# EAGLE design carret (EAGLE 5.11)
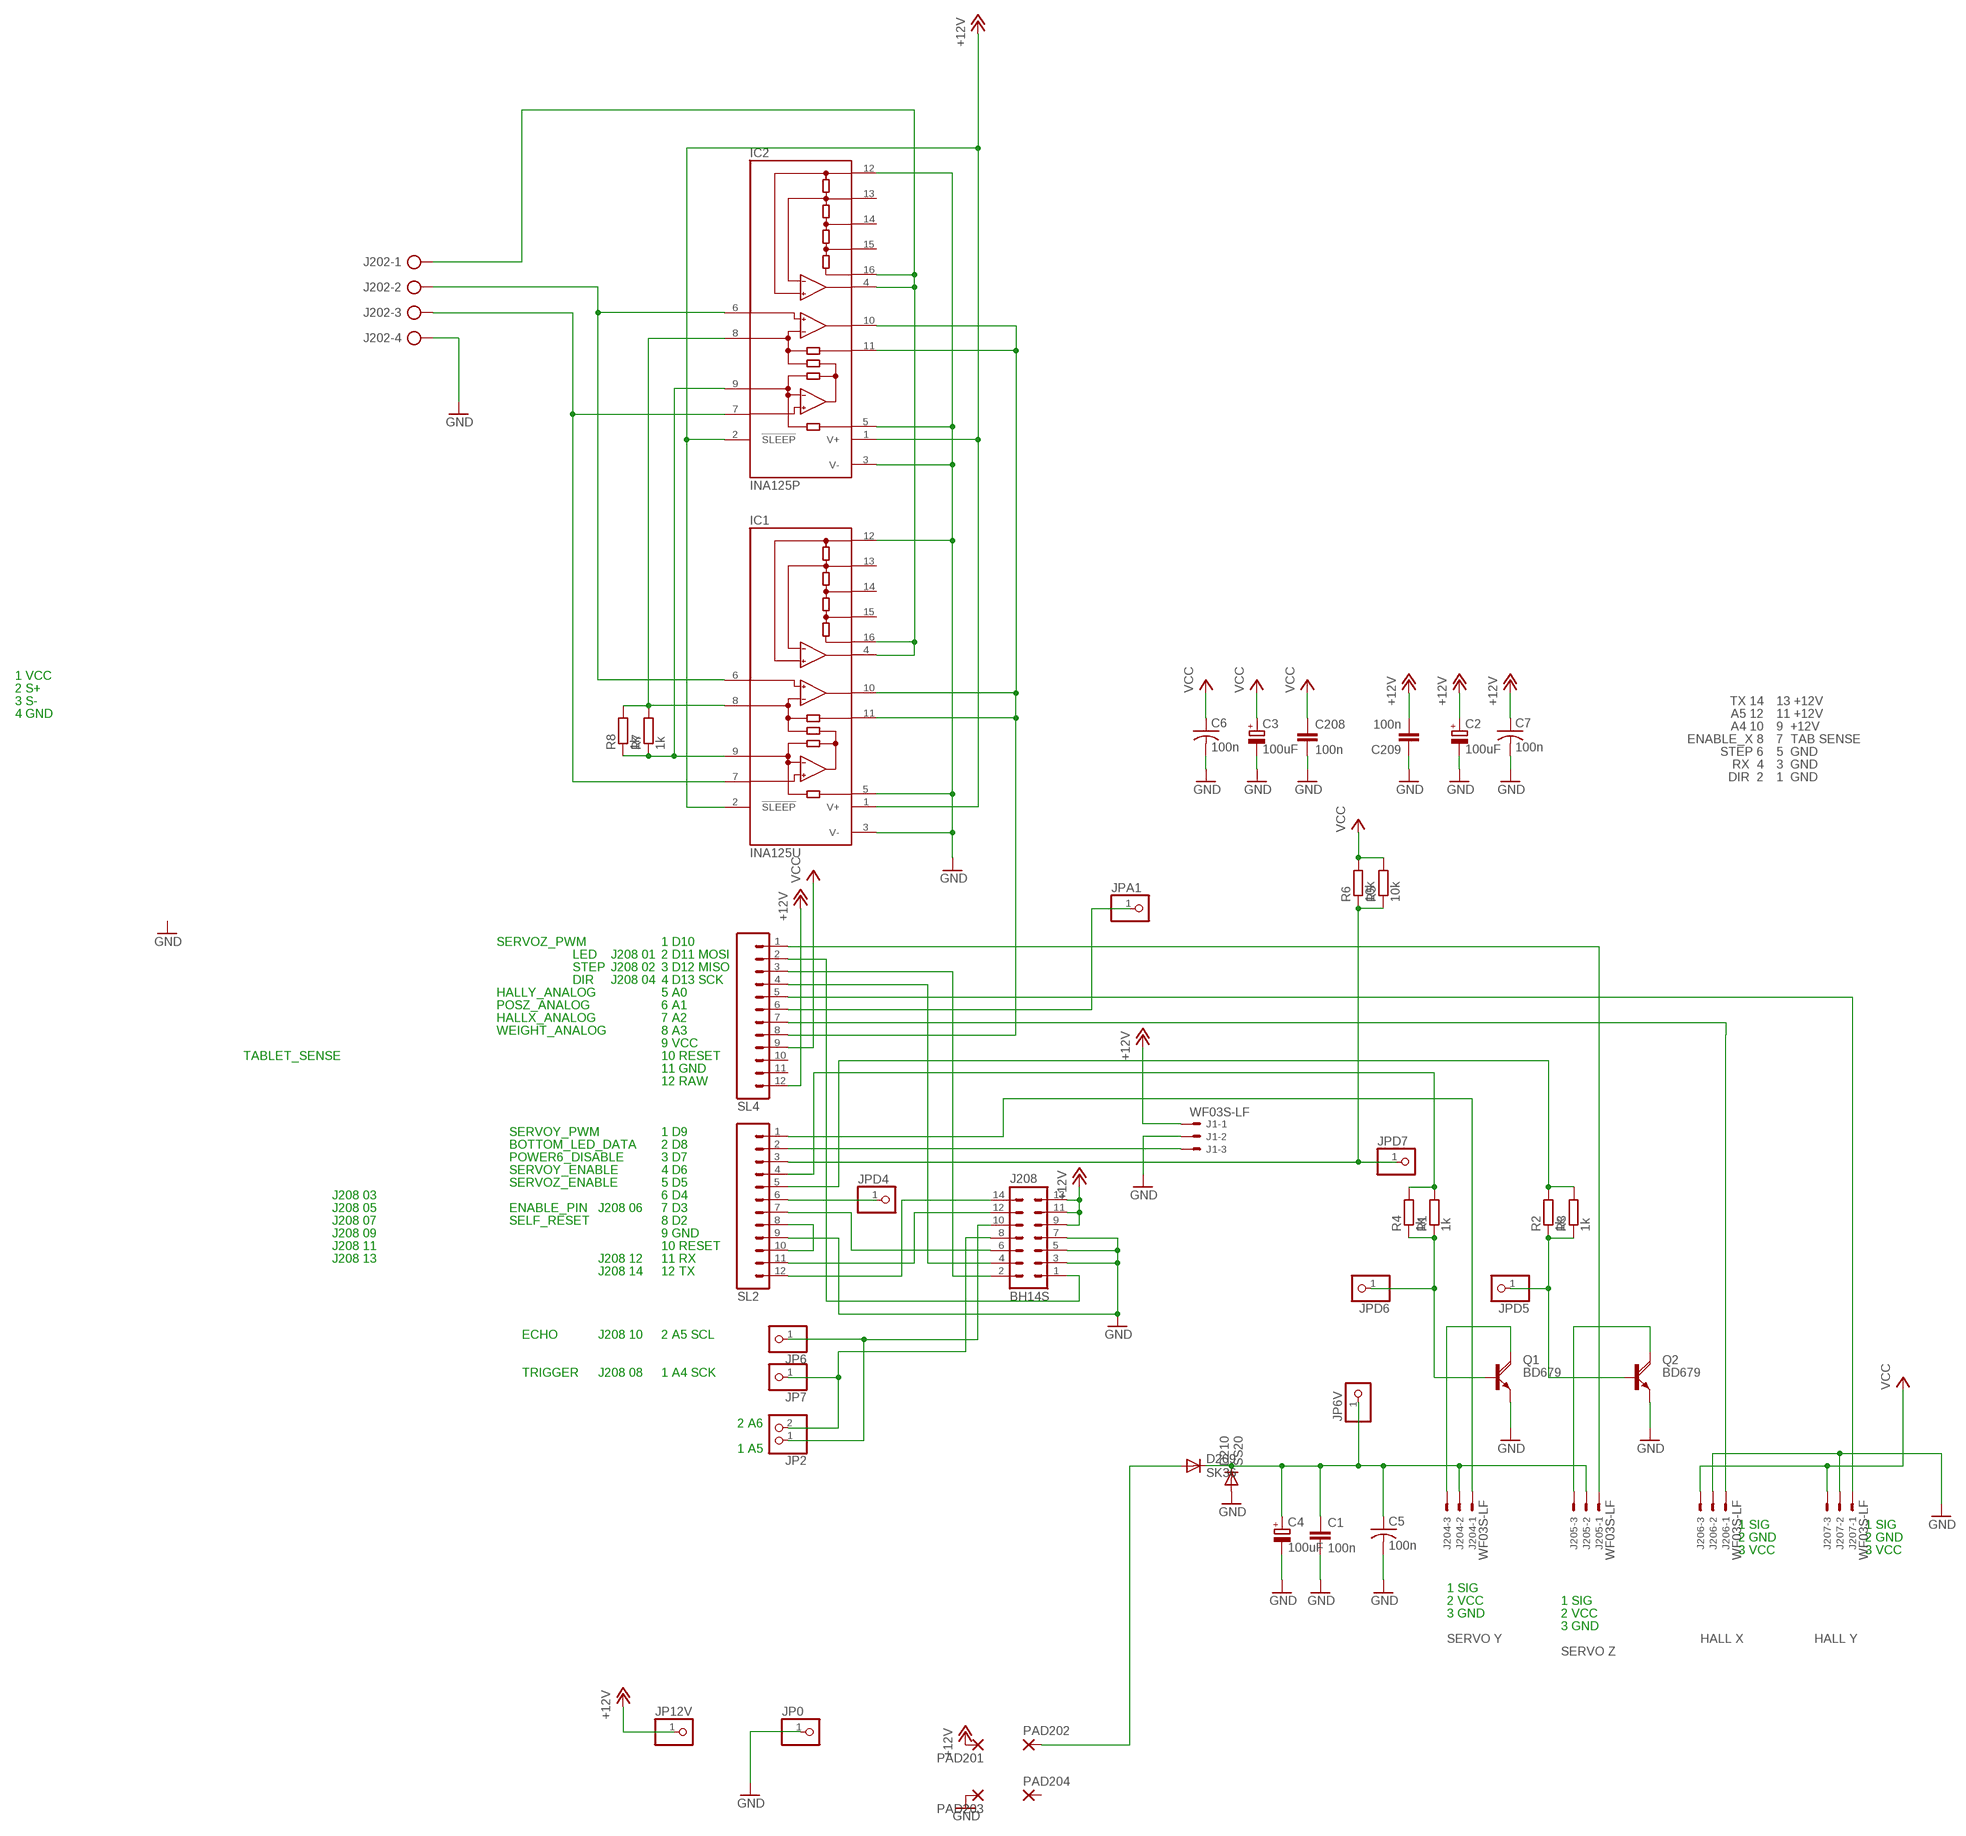
[diagram p0: schematic, sheet 1]

## Parts
C1  100n  CAP  [0805]
C2  100uF  CPOL-EUE3.5-8  [E3,5-8]
C3  100uF  CPOL-EUE3.5-8  [E3,5-8]
C4  100uF  CPOL-EUE3.5-8  [E3,5-8]
C5  100n  C-US050-030X075  [C050-030X075]
C6  100n  C-US050-030X075  [C050-030X075]
C7  100n  C-US050-030X075  [C050-030X075]
C208  100n  CAP  [0805]
C209  100n  CAP  [0805]
D209  SK36  DIODE-SMC  [SMC]
D210  SS20  DIODE-DO214AA  [DO214AA]
IC1  INA125U  [SO16-1]
IC2  INA125P  [DIL16]
J1  WF03S-LF  22-27-2031-03  [6410-03]
J202  AK300/4  [AK300/4]
J204  WF03S-LF  22-27-2031-03  [6410-03]
J205  WF03S-LF  22-27-2031-03  [6410-03]
J206  WF03S-LF  22-27-2031-03  [6410-03]
J207  WF03S-LF  22-27-2031-03  [6410-03]
J208  BH14S  ML14  [ML14]
JP0  PINHD-1X1  [1X01]
JP2  PINHD-1X2  [1X02]
JP6  PINHD-1X1  [1X01]
JP6V  PINHD-1X1  [1X01]
JP7  PINHD-1X1  [1X01]
JP12V  PINHD-1X1  [1X01]
JPA1  PINHD-1X1  [1X01]
JPD4  PINHD-1X1  [1X01]
JPD5  PINHD-1X1  [1X01]
JPD6  PINHD-1X1  [1X01]
JPD7  PINHD-1X1  [1X01]
PAD201  3,81/1,1  [3,81/1,1]
PAD202  3,81/1,1  [3,81/1,1]
PAD203  3,81/1,1  [3,81/1,1]
PAD204  3,81/1,1  [3,81/1,1]
Q1  BD679  [TO126AV]
Q2  BD679  [TO126AV]
R1  1k  RES0805  [0805]
R2  1k  RES0805  [0805]
R3  1k  R-EU_0207/10  [0207/10]
R4  1k  R-EU_0207/10  [0207/10]
R5  10k  RES0805  [0805]
R6  10k  R-EU_0207/10  [0207/10]
R7  1k  RES0805  [0805]
R8  1k  R-EU_0207/10  [0207/10]
SL2  M12  [12P]
SL4  M12  [12P]

## Nets
+12V [power12]: C2.+ C7.1 C209.2 IC1.1(V+) IC1.2(!SLEEP) IC2.1(V+) IC2.2(!SLEEP) J1.1 J208.9 J208.11 J208.13 JP12V.1 PAD201.1(P) SL4.12
GND [ground]: C1.2 C2.- C3.- C4.- C5.2 C6.2 C7.2 C208.2 C209.1 D210.A IC1.3(V-) IC1.5(REF) IC1.12(REFCOM) IC2.3(V-) IC2.5(REF) IC2.12(REFCOM) J1.2 J202.4 J206.2 J207.2 J208.3 J208.5 J208.7 JP0.1 PAD203.1(P) Q1.E Q2.E SL2.9
N$1: JPD6.1 Q1.B R1.1 R4.1
N$2: J208.14 SL2.12
N$3: J1.3 SL2.2
N$4: JPD7.1 R5.1 R6.1 SL2.3
N$5: J206.1 SL4.7
N$6: J208.1 SL4.2
N$7: J208.12 SL2.11
N$8: J208.2 SL4.3
N$9: J208.10 JP2.1 JP6.1
N$10: J205.1 SL4.1
N$11: J208.8 JP2.2 JP7.1
N$12: J208.4 SL4.4
N$13: IC1.6(+IN) IC2.6(+IN) J202.2
N$14 [power12]: D209.A PAD202.1(P)
N$15: SL2.8 SL2.10
N$16: J207.1 SL4.5
N$17: J204.3 Q1.C
N$18: R1.2 R4.2 SL2.4
N$19: R2.2 R3.2 SL2.5
N$20: J205.3 Q2.C
N$21: J204.1 SL2.1
N$22 [power6]: C1.1 C4.+ C5.1 D209.C D210.C J204.2 J205.2 JP6V.1
N$23: JPD5.1 Q2.B R2.1 R3.1
N$24: JPD4.1 SL2.6
N$25: IC1.4(REFOUT) IC1.16(REF10) IC2.4(REFOUT) IC2.16(REF10) J202.1
N$26: IC1.7(-IN) IC2.7(-IN) J202.3
N$27: J208.6 SL2.7
N$28: JPA1.1 SL4.6
N$30: IC1.8(RG) IC2.8(RG) R7.2 R8.2
N$31: IC1.9(RG) IC2.9(RG) R7.1 R8.1
N$41: IC1.10(OUT) IC1.11(SENSE) IC2.10(OUT) IC2.11(SENSE) SL4.8
VCC [power5]: C3.+ C6.1 C208.1 J206.3 J207.3 R5.2 R6.2 SL4.9
Unconnected: IC1.13(REFBG) IC1.14(REF2.5) IC1.15(REF5) IC2.13(REFBG) IC2.14(REF2.5) IC2.15(REF5) PAD204.1(P) SL4.10 SL4.11

## Notes on the sheet
- 1 VCC
- 2 S+
- 3 S- | TX 14 | 13 +12V
- 4 GND | A5 12 | 11 +12V
- A4 10 | 9  +12V
- ENABLE_X 8 | 7  TAB SENSE
- STEP 6 | 5  GND
- RX  4 | 3  GND
- DIR  2 | 1  GND
- SERVOZ_PWM | 1 D10
- LED | J208 01 | 2 D11 MOSI
- STEP | J208 02 | 3 D12 MISO
- DIR | J208 04 | 4 D13 SCK
- HALLY_ANALOG | 5 A0
- POSZ_ANALOG | 6 A1
- HALLX_ANALOG | 7 A2
- WEIGHT_ANALOG | 8 A3
- 9 VCC
- TABLET_SENSE | 10 RESET
- 11 GND
- 12 RAW
- SERVOY_PWM | 1 D9
- BOTTOM_LED_DATA | 2 D8
- POWER6_DISABLE | 3 D7
- SERVOY_ENABLE | 4 D6
- SERVOZ_ENABLE | 5 D5
- J208 03 | 6 D4
- J208 05 | ENABLE_PIN | J208 06 | 7 D3
- J208 07 | SELF_RESET | 8 D2
- J208 09 | 9 GND
- J208 11 | 10 RESET
- J208 13 | J208 12 | 11 RX
- J208 14 | 12 TX
- ECHO | J208 10 | 2 A5 SCL
- TRIGGER | J208 08 | 1 A4 SCK
- 2 A6
- 1 A5
- 1 SIG | 1 SIG
- 2 GND | 2 GND
- 3 VCC | 3 VCC
- 1 SIG
- 2 VCC | 1 SIG
- 3 GND | 2 VCC
- 3 GND
- SERVO Y | HALL X | HALL Y
- SERVO Z

## Library data of the parts
C1 C208 C209 = barobot:CAP
C2-C4 = rcl:CPOL-EU: POLARIZED CAPACITOR, European symbol
C5-C7 = resistor:C-US: CAPACITOR, American symbol
D209 D210 = diode:DIODE-: DIODE
IC1 = burr-brown:INA125: Instrumentation Amplifier with Precision Voltage Reference; MF: TEXAS INSTRUMENT CONNECTORS; MPN: INA125U; OC_FARNELL: 1304375; OC_NEWARK: 80K5901
IC2 = burr-brown:INA125: Instrumentation Amplifier with Precision Voltage Reference; MF: TEXAS INSTRUMENT CONNECTORS; MPN: INA125P; OC_FARNELL: 1459461; OC_NEWARK: 35C1726
J1 J204-J207 = con-molex:22-?-03: CONNECTOR wire to board 2.54 mm (.1 inch) pitch header; OC_FARNELL: unknown; OC_NEWARK: unknown
J202 = con-ptr500:AK300/4: CONNECTOR
J208 = con-ml:ML14: HARTING
JP0 JP6 JP6V JP7 JP12V JPA1 JPD4-JPD7 = pinhead:PINHD-1X1: PIN HEADER
JP2 = pinhead:PINHD-1X2: PIN HEADER
PAD201-PAD204 = wirepad:3,81/1,1: THROUGH-HOLE PAD
Q1 Q2 = transistor-power:BD679: NPN DARLINGTON TRANSISTOR
R1 R2 R5 R7 = barobot:RES
R3 R4 R6 R8 = rcl:R-EU_: RESISTOR, European symbol
SL2 SL4 = con-amp-quick:M12: AMP QUICK CONNECTOR; OC_FARNELL: unknown; OC_NEWARK: unknown

## Net classes
0 default: width 0.381 mm, drill 0.254 mm, clearance 0.254 mm
1 power12: width 1.27 mm
2 ground: width 0.508 mm
3 power5: width 0.508 mm
4 power6: width 0.813 mm

## Board
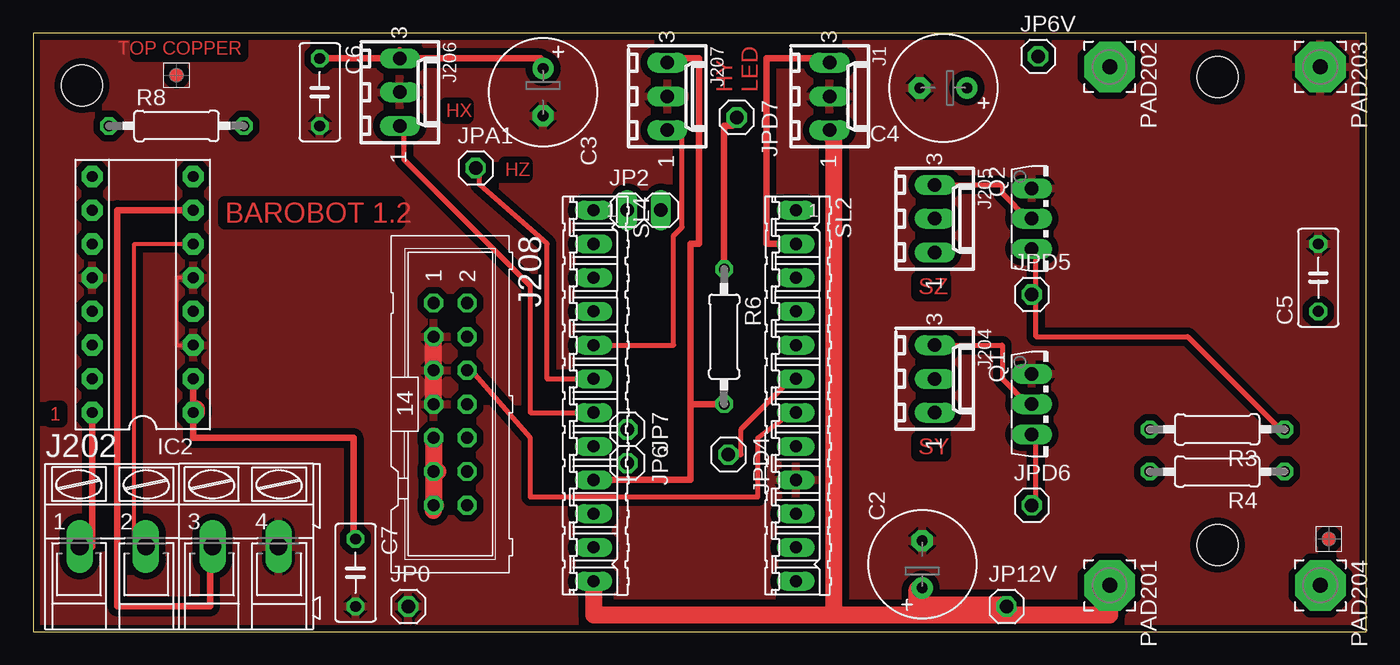
[diagram p1: board, top side]
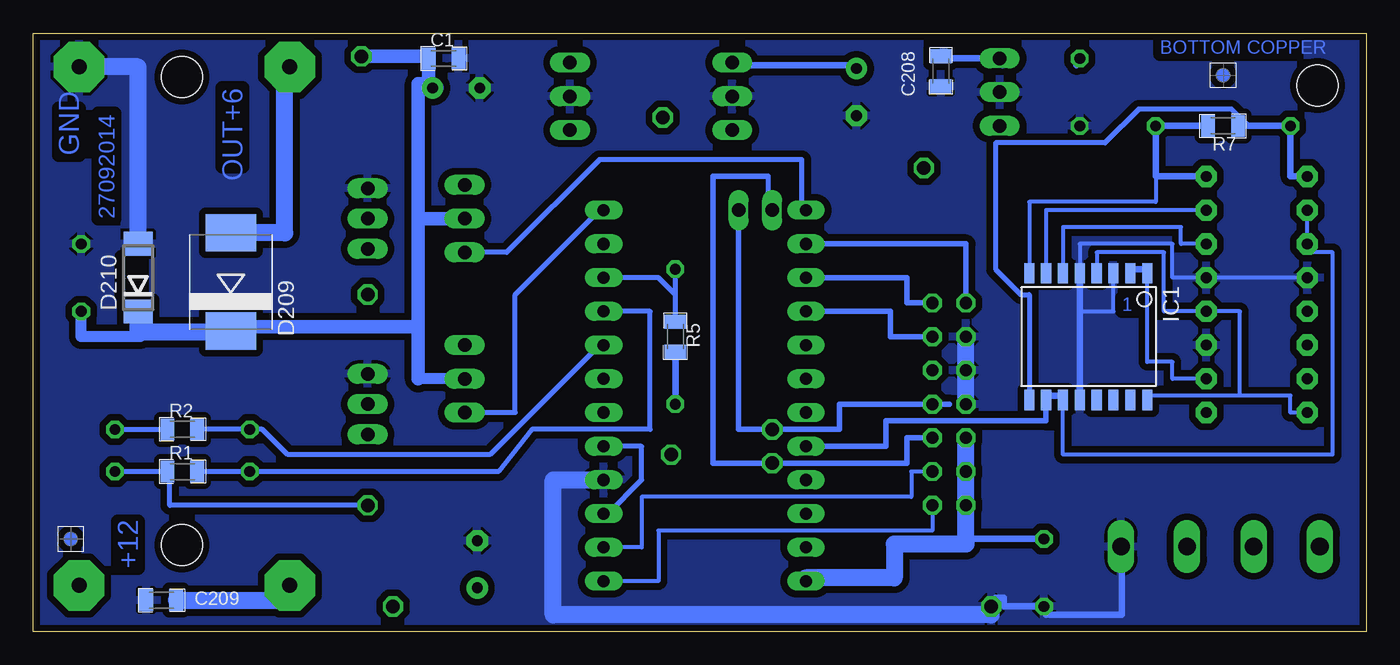
[diagram p2: board, bottom side, seen from below]

Size 100.46 x 45.09 mm. Coordinates in mm from the lower left corner, seen from the top.
Outline: 0,0 100.46,0 100.46,45.09 0,45.09 0,0
Copper layers (1*16): Top 0.035mm / dielectric 1.5mm / Bottom 0.035mm
Design rules "default *": minimum track width 10mil, minimum drill 0.5mm, track to track 10mil, track to pad 10mil, pad to pad 8mil, via to via 10mil, smd to smd 8mil, copper to edge 20mil, drill to drill 8mil, minimum pad ring 10mil, minimum via ring 8mil, stop-mask expansion 0mil, vias tented up to drill 0mil, thermal gap 10mil
Holes 3.1 mm at 89.23,6.54 89.25,41.78 3.68,41.15
bRestrict: area 92.2,25.4 to 93.8,28.3

### Footprints (pad centres in the part's own frame; a part is rotated, then mirrored left to right if it is on the bottom)
0805 = smd 1.044 x 1.6: 1 -1.127,0; 2 1.127,0
E3,5-8 = drill 0.813 pad 1.6 round: + -1.778,0 | drill 0.813 pad 1.6 octagon: - 1.778,0
C050-030X075 = drill 0.813 octagon: 1 -2.54,0; 2 2.54,0
SMC = smd 2.8 x 3.8: A 3.7,0; C -3.7,0
DO214AA = smd 1.8 x 2.2: A 2.55,0; C -2.55,0
SO16-1 = smd 0.762 x 1.524: 1 -4.445,-4.775; 2 -3.175,-4.775; 3 -1.905,-4.775; 4 -0.635,-4.775; 5 0.635,-4.775; 6 1.905,-4.775; 7 3.175,-4.775; 8 4.445,-4.775; 9 4.445,4.775; 10 3.175,4.775; 11 1.905,4.775; 12 0.635,4.775; 13 -0.635,4.775; 14 -1.905,4.775; 15 -3.175,4.775; 16 -4.445,4.775
DIL16 = drill 0.813 pad 1.6 octagon: 1 -8.89,-3.81; 2 -6.35,-3.81; 3 -3.81,-3.81; 4 -1.27,-3.81; 5 1.27,-3.81; 6 3.81,-3.81; 7 6.35,-3.81; 8 8.89,-3.81; 9 8.89,3.81; 10 6.35,3.81; 11 3.81,3.81; 12 1.27,3.81; 13 -1.27,3.81; 14 -3.81,3.81; 15 -6.35,3.81; 16 -8.89,3.81
6410-03 = drill 1.016 long: 1 2.54,0; 2 0,0; 3 -2.54,0
AK300/4 = drill 1.321 long: 1 -7.493,0; 2 -2.515,0; 3 2.515,0; 4 7.493,0
ML14 = drill 0.914 octagon: 1 -7.62,-1.27; 2 -7.62,1.27; 3 -5.08,-1.27; 4 -5.08,1.27; 5 -2.54,-1.27; 6 -2.54,1.27; 7 0,-1.27; 8 0,1.27; 9 2.54,-1.27; 10 2.54,1.27; 11 5.08,-1.27; 12 5.08,1.27; 13 7.62,-1.27; 14 7.62,1.27
1X01 = drill 1.016 octagon: 1 0,0
1X02 = drill 1.016 long: 1 -1.27,0; 2 1.27,0
3,81/1,1 = drill 1.118 pad 3.81 octagon: 1 0,0
TO126AV = drill 1.016 long: B 2.286,-1.27; C 0,-1.27; E -2.286,-1.27
0207/10 = drill 0.813 octagon: 1 -5.08,0; 2 5.08,0
12P = drill 0.914 long: 1 -13.97,0; 2 -11.43,0; 3 -8.89,0; 4 -6.35,0; 5 -3.81,0; 6 -1.27,0; 7 1.27,0; 8 3.81,0; 9 6.35,0; 10 8.89,0; 11 11.43,0; 12 13.97,0

### Placement (x,y rotation side)
C1  69.53,43.18 0 bottom
C2  66.99,5.08 90 top
C3  38.42,40.64 270 top
C4  68.58,40.96 180 top
C5  96.84,26.67 90 top
C6  21.59,40.64 270 top
C7  24.29,4.45 270 top
C208  32.07,42.23 270 bottom
C209  90.8,2.38 0 bottom
D209  85.57,26.35 90 bottom
D210  92.55,26.67 90 bottom
IC1  20.95,22.23 180 bottom
IC2  8.26,25.4 90 top
J1  60.01,40.32 270 top
J202  11,6.42 0 top
J204  67.94,19.05 270 top
J205  67.94,31.11 270 top
J206  27.62,40.64 270 top
J207  47.78,40.32 270 top
J208  31.43,17.14 270 top
JP0  28.26,1.91 0 top
JP2  46.04,31.75 0 top
JP6  44.77,12.7 270 top
JP6V  75.72,43.34 0 top
JP7  44.77,15.24 270 top
JP12V  73.34,1.91 0 top
JPA1  33.34,34.92 0 top
JPD4  52.39,13.34 270 top
JPD5  75.25,25.4 0 top
JPD6  75.25,9.53 0 top
JPD7  53.02,38.73 270 top
PAD201  81.12,3.49 270 top
PAD202  81.12,42.55 270 top
PAD203  97,42.55 270 top
PAD204  97,3.49 270 top
Q1  76.52,17.14 270 top
Q2  76.52,31.11 270 top
R1  89.22,12.06 0 bottom
R2  89.22,15.24 0 bottom
R3  89.22,15.24 180 top
R4  89.22,12.06 180 top
R5  52.07,22.23 270 bottom
R6  52.07,22.23 270 top
R7  10.79,38.1 180 bottom
R8  10.79,38.1 0 top
SL2  57.47,17.78 270 top
SL4  42.23,17.78 270 top
U$1  [FIDUCIAL_G10S]  10.79,41.91 0 top
U$2  [FIDUCIAL_G10S]  97.63,6.99 0 top
U$3  [FIDUCIAL_G10S]  97.63,6.99 0 bottom
U$4  [FIDUCIAL_G10S]  10.79,41.91 0 bottom

### Tracks (layer width: path | path; a pad name or v marks a point on that pad's centre or on a via)
+12V
  Top 0.508: IC2.2 IC2.1 12.06,14.61 24.13,14.61 24.13,6.99 C7.1
  Top 1.27: 30.29,11.94 30.16,11.94 J208.11 30.48,12.06 | J208.13 30.29,9.53 | SL4.12 42.23,1.27 60.33,1.27 | 60.33,1.27 66.61,1.27 | PAD201.1 81.12,1.27 66.61,1.27 | 30.16,14.73 J208.9 30.16,14.22 30.16,9.14 | C2.+ 66.99,3.17 66.61,3.17 66.61,2.03 | 66.61,1.27 66.61,2.03 | JP12V.1 73.34,2.03 66.61,2.03 | 60.33,1.27 60.33,37.47 60.01,37.47 J1.1 | IC2.1 12.32,16.51 12.32,16.76
  Bottom 0.305: IC1.1 16.51,20.32 14.61,20.32 14.61,19.05 IC2.2
  Bottom 0.508: IC1.1 16.51,27.3 17.78,27.3 IC1.2 | C7.1 30.16,6.99
  Bottom 1.016: J208.11 | J208.9
  Bottom 1.27: 30.16,9.4 J208.13 30.16,9.37 | 41.85,3.81 SL4.12 42.23,4.06 35.56,4.06 35.56,6.6 30.16,6.6 30.16,6.99 30.16,9.37 | C209.2 89.63,2.38 89.63,2.35 81.12,2.35 PAD201.1 80.99,3.49 80.99,3.11 | 30.16,9.37 J208.11 J208.9
GND
  Top 0.305: IC2.3 10.79,21.59 10.79,26.67 IC2.5
  Top 1.27: J208.7 J208.3
  Bottom 0.305: 28.26,1.27 28.57,1.27 | 28.26,1.27 | IC1.5 21.59,29.21 14.61,29.21 14.61,26.67 IC2.5 IC2.12 | IC1.3 19.05,24.13 21.59,24.13
  Bottom 0.508: JP0.1 27.94,1.91 27.94,2.54 27.3,2.54 27.3,1.91 C7.2 24.13,1.91 24.13,1.27 18.41,1.27 18.41,6.35 18.49,6.35 J202.4 | IC1.5 21.59,24.13 IC1.12
  Bottom 1.016: C4.- 66.99,40.96
  Bottom 1.27: 28.26,1.27 61.28,1.27 61.28,11.43 SL2.9 | J208.7 J208.5 J208.3 | PAD203.1 92.55,42.55 D210.A
  pour Top (isolate 0.508, rank 3): 0,45.09 100.33,45.09 100.33,0 0,0
  pour Bottom (isolate 0.508): 0,45.09 100.33,45.09 100.46,0 0,0
N$1
  Top 0.381: Q1.B 75.56,14.61 75.56,9.53 JPD6.1
  Bottom 0.381: JPD6.1 90.17,9.53 90.17,12.06 R1.1 90.81,12.06 93.98,12.06 R4.1
N$2
  Bottom 0.305: J208.14 32.7,7.62 53.34,7.62 53.34,3.81 SL2.12
N$3
  Top 0.508: J1.3 60.01,43.18 55.24,43.18 55.24,29.21 SL2.2
N$4
  Top 0.508: R6.1 52.07,38.1 52.7,38.1 52.7,38.73 JPD7.1
  Bottom 0.381: 52.07,25.4 R6.1 | R5.1 52.07,25.4 | 52.07,25.4 53.34,26.67 SL2.3
N$5
  Top 0.381: SL4.7 37.47,16.51 37.47,26.04 27.94,35.56 27.94,38.1 J206.1
N$6
  Bottom 0.406: SL4.2 30.16,29.21 J208.1
N$7
  Bottom 0.305: J208.12 34.29,12.06 34.29,10.16 54.61,10.16 54.61,6.35 SL2.11
N$8
  Bottom 0.406: J208.2 34.61,24.77 34.61,26.67 SL4.3
N$9
  Bottom 0.381: 45.09,34.29 45.09,31.75 JP2.1
  Bottom 0.406: J208.10 34.61,14.61 34.61,12.7 JP6.1 49.21,12.7 49.21,34.29 45.09,34.29
N$10
  Bottom 0.381: SL4.1 42.55,31.75 42.55,35.56 57.78,35.56 64.77,28.57 J205.1
N$11
  Bottom 0.406: 47.31,22.86 JP2.2 | 31.43,17.14 J208.8 39.69,17.14 39.69,15.24 JP7.1 47.31,15.24 47.31,22.86 | 47.31,22.86
N$12
  Bottom 0.406: J208.4 35.88,22.23 35.88,24.13 SL4.4
N$13
  Top 0.305: IC2.6 7.62,29.21 7.62,6.99 8.26,6.99 8.26,6.42 J202.2
  Bottom 0.305: IC1.6 22.86,30.48 13.97,30.48 13.97,29.21 IC2.6
N$14
  Bottom 1.27: D209.A 85.57,30.04 81.5,30.04 81.5,42.55 PAD202.1
N$15
  Bottom 0.381: SL2.10 57.15,8.89 54.61,11.43 54.61,13.97 SL2.8
N$16
  Top 0.381: SL4.5 48.26,21.59 48.26,29.84 48.9,30.48 48.9,37.47 48.26,38.1 J207.1
N$17
  Top 0.381: J204.3 73.03,21.59 73.03,19.05 74.93,17.14 Q1.C | J204.3
N$18
  Bottom 0.381: 84.45,12.06 87.63,12.06 R1.2 | 84.45,12.06 65.41,12.06 62.87,15.24 53.98,15.24 53.98,24.13 SL2.4 | 84.45,12.06 R4.2
N$19
  Bottom 0.381: R2.2 R3.2 83.19,15.24 81.28,13.34 66.04,13.34 57.78,21.59 SL2.5
N$20
  Top 0.381: J205.3 73.03,33.66 73.03,33.02 74.93,31.11 Q2.C | J205.3
N$21
  Bottom 0.381: SL2.1 57.78,31.75 64.14,25.4 64.14,16.51 J204.1
N$22
  Bottom 0.813: 87.06,21.97 85.57,21.97 85.57,22.54 | D209.C 85.03,22.65 85.03,22.99 | 96.71,24 96.84,24 C5.1 96.84,22.23 92.39,22.23 92.39,22.54 | 70.36,41.27 C4.+ | J204.2 71.44,19.05
  Bottom 1.016: 71.44,22.99 85.03,22.99 | 71.44,19.05 71.44,22.99 | 70.36,41.27 71.44,41.27 71.44,31.11 | 71.44,31.11 J205.2 | 71.44,22.99 71.44,31.11 | 70.02,40.96 C4.+ 70.66,40.96 C1.1 70.66,43.34 JP6V.1
  Bottom 1.27: D210.C 92.55,22.54 92.39,22.54 85.57,22.54 D209.C
N$23
  Top 0.381: 75.56,25.4 75.56,28.57 Q2.B | 75.56,25.4 75.56,22.23 87,22.23 93.98,15.24 R3.1 | 75.56,25.4 JPD5.1
  Bottom 0.381: R3.1 R2.1
N$24
  Top 0.381: SL2.6 57.15,19.05 53.34,15.24 53.34,13.34 JPD4.1
N$25
  Top 0.381: J202.1 3.81,6.35 4.45,6.35 4.45,6.42
  Top 0.508: 4.45,6.42 IC2.16
  Bottom 0.305: 9.53,17.78 5.71,17.78 5.71,16.51 IC2.16 | 9.53,17.78 16.51,17.78 IC1.16 | 9.53,17.78 9.53,24.13 IC2.4 15.24,24.13 15.24,28.57 20.32,28.57 IC1.4
N$26
  Top 0.508: J202.3 13.52,6.35 13.34,6.35 13.34,1.91 6.35,1.91 6.35,31.75 IC2.7
  Bottom 0.305: IC1.7 24.13,31.75 IC2.7
N$27
  Top 0.381: J208.6 33.02,19.68 37.47,14.61 37.47,10.16 54.61,10.16 54.61,14.61 57.15,16.51 SL2.7
N$28
  Top 0.381: SL4.6 38.73,19.05 38.73,29.21 33.66,33.66 33.66,34.92 JPA1.1
N$30
  Bottom 0.305: IC1.8 25.4,32.38 15.88,32.38 15.88,34.29
  Bottom 0.508: IC2.8 15.88,34.29 R8.2 R7.2
N$31
  Bottom 0.381: 8.89,38.1 10.16,39.37 17.14,39.37 19.68,36.83 27.94,36.83 27.94,27.3 26.04,25.4 25.4,25.4 IC1.9
  Bottom 0.508: IC2.9 5.71,34.29 R8.1 8.89,38.1 R7.1
N$41
  Bottom 0.305: IC2.10 IC2.11 4.45,28.57 2.54,28.57 2.54,13.34 22.86,13.34 IC1.11
  Bottom 0.406: SL4.8 36.2,13.97 36.2,15.88 24.13,15.88 IC1.10
  Bottom 0.508: IC1.11 22.86,17.78 24.13,17.78 IC1.10
VCC
  Top 0.508: J206.3 27.62,43.81 | J206.3 C6.1 | 42.23,11.68 SL4.9 49.53,11.43 49.53,17.14 | 38.1,43.18 38.23,43.18 | 38.1,43.18 J206.3 | 38.1,43.18 38.1,42.67 38.61,42.67 38.61,42.42 C3.+ | 49.53,17.14 R6.2 | 49.53,17.14 49.53,29.21 50.16,29.21 50.16,43.18 47.78,43.18 J207.3
  Bottom 0.508: 21.84,42.67 21.84,43.18 C6.1 | 27.43,42.67 27.43,43.18 J206.3 31.62,43.18 31.62,43.69 32.07,43.69 C208.1 | C208.1 32.07,43.18 | C208.1 32.07,43.66 | J207.3 47.75,42.86 47.75,43.18 47.24,43.18 47.24,42.67 38.42,42.67 C3.+ | R6.2 R5.2

### Text on the board
Top: TOP COPPER | HY | LED | HX | HZ | BAROBOT 1.2 | SZ | 1 | SY
Bottom: BOTTOM COPPER | OUT+6 | GND | 27092014 | 1 | +12